# EAGLE schematic comparator_circuit (EAGLE 7.2.0)
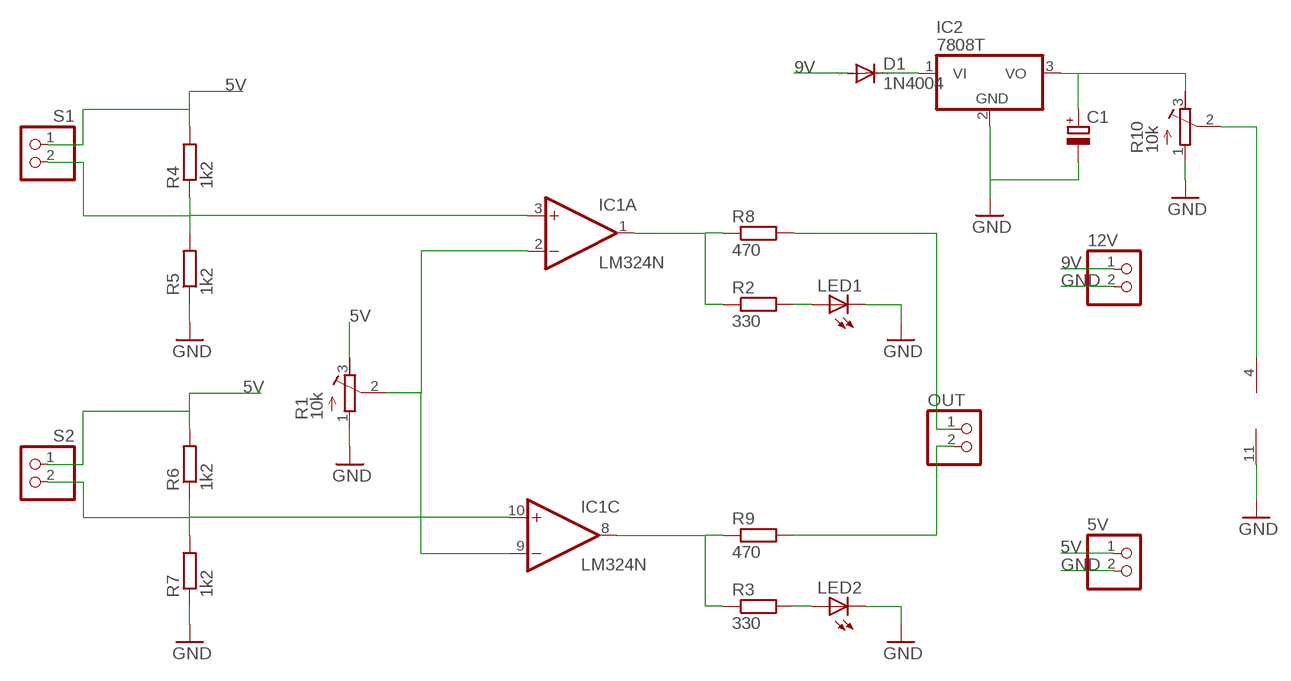
[diagram p0: schematic, sheet 1]

## Parts
5V  PINHD-1X2  [1X02]
12V  PINHD-1X2  [1X02]
C1  CPOL-EUE2.5-6  [E2,5-6]
D1  1N4004  [DO41-10]
IC1  LM324N  [DIL14]
IC2  7808T  [TO220H]
LED1  LED3MM  [LED3MM]
LED2  LED3MM  [LED3MM]
OUT  PINHD-1X2  [1X02]
R1  10k  R-TRIMM3339P  [RTRIM3339P]
R2  330  R-EU_0204/7  [0204/7]
R3  330  R-EU_0204/7  [0204/7]
R4  1k2  R-EU_0204/7  [0204/7]
R5  1k2  R-EU_0204/7  [0204/7]
R6  1k2  R-EU_0204/7  [0204/7]
R7  1k2  R-EU_0204/7  [0204/7]
R8  470  R-EU_0204/7  [0204/7]
R9  470  R-EU_0204/7  [0204/7]
R10  10k  R-TRIMM3339P  [RTRIM3339P]
S1  PINHD-1X2  [1X02]
S2  PINHD-1X2  [1X02]

## Nets
5V: 5V.1 R1.3(E) R4.2 R6.2 S1.1 S2.1
9V: 12V.1 D1.A
GND: 5V.2 12V.2 C1.- IC1.11(P:V-) IC2.2(GND) LED1.K(C) LED2.K(C) R1.1(A) R5.1 R7.1 R10.1(A)
N$1: IC1.2(A:-IN) IC1.9(C:-IN) R1.2(S)
N$2: D1.C IC2.1(VI)
N$3: LED1.A R2.2
N$4: LED2.A R3.2
N$6: IC1.8(C:OUT) R3.1 R9.1
N$7: IC1.3(A:+IN) R4.1 R5.2 S1.2
N$8: IC1.10(C:+IN) R6.1 R7.2 S2.2
N$9: C1.+ IC2.3(VO) R10.3(E)
N$10: IC1.4(P:V+) R10.2(S)
N$13: OUT.1 R8.2
N$14: OUT.2 R9.2
N$21: IC1.1(A:OUT) R2.1 R8.1
Unconnected: IC1.5(B:+IN) IC1.6(B:-IN) IC1.7(B:OUT) IC1.12(D:+IN) IC1.13(D:-IN) IC1.14(D:OUT)

## Library data of the parts
5V 12V OUT S1 S2 = pinhead:PINHD-1X2: PIN HEADER
C1 = rcl:CPOL-EU: POLARIZED CAPACITOR, European symbol
D1 = diode:1N4004: DIODE general purpose rectifier, 1 A
IC1 = linear:LM324: OP AMP
IC2 = linear:78*: Positive VOLTAGE REGULATOR Source: http://cache.national.com/ds/LM/LM78L05.pdf http://www.fairchildsemi.com/ds/LM/LM7805.pdf
LED1 LED2 = led:LED: LED OSRAM: - CHIPLED LG R971, LG N971, LY N971, LG Q971, LY Q971, LO R971, LY R971 LH N974, LH R974 LS Q976, LO Q976, LY Q976 LO Q996 - Hyper CHIPLED LW Q18S LB Q993, LB Q99A, LB R99A - SideLED LS A670, LO A670, LY A670, LG A670, LP A670 LB A673, LV A673, LT A673, LW A673 LH A674 LY A675 LS A676, LA A676, LO A676, LY A676, LW A676 LS A679, LY A679, LG A679 - Hyper Micro SIDELED® LS Y876, LA Y876, LO Y876, LY Y876 LT Y87S - SmartLED LW L88C, LW L88S LB L89C, LB L89S, LG L890 LS L89K, LO L89K, LY L89K LS L896, LA L896, LO L896, LY L896 - TOPLED LS T670, LO T670, LY T670, LG T670, LP T670 LSG T670, LSP T670, LSY T670, LOP T670, LYG T670 LG T671, LOG T671, LSG T671 LB T673, LV T673, LT T673, LW T673 LH T674 LS T676, LA T676, LO T676, LY T676, LB T676, LH T676, LSB T676, LW T676 LB T67C, LV T67C, LT T67C, LS T67K, LO T67K, LY T67K, LW E67C LS E67B, LA E67B, LO E67B, LY E67B, LB E67C, LV E67C, LT E67C LW T67C LS T679, LY T679, LG T679 LS T770, LO T770, LY T770, LG T770, LP T770 LB T773, LV T773, LT T773, LW T773 LH T774 LS E675, LA E675, LY E675, LS T675 LS T776, LA T776, LO T776, LY T776, LB T776 LHGB T686 LT T68C, LB T68C - Hyper Mini TOPLED® LB M676 - Mini TOPLED Santana® LG M470 LS M47K, LO M47K, LY M47K Source: http://www.osram.convergy.de LUXEON: - LUMILED® LXK2-PW12-R00, LXK2-PW12-S00, LXK2-PW14-U00, LXK2-PW14-V00 LXK2-PM12-R00, LXK2-PM12-S00, LXK2-PM14-U00 LXK2-PE12-Q00, LXK2-PE12-R00, LXK2-PE12-S00, LXK2-PE14-T00, LXK2-PE14-U00 LXK2-PB12-K00, LXK2-PB12-L00, LXK2-PB12-M00, LXK2-PB14-N00, LXK2-PB14-P00, LXK2-PB14-Q00 LXK2-PR12-L00, LXK2-PR12-M00, LXK2-PR14-Q00, LXK2-PR14-R00 LXK2-PD12-Q00, LXK2-PD12-R00, LXK2-PD12-S00 LXK2-PH12-R00, LXK2-PH12-S00 LXK2-PL12-P00, LXK2-PL12-Q00, LXK2-PL12-R00 Source: www.luxeon.com KINGBRIGHT: KA-3528ASYC Source: www.kingbright.com
R1 R10 = rcl:R-TRIMM: Trimm resistor
R2-R9 = rcl:R-EU_: RESISTOR, European symbol